# Altium project PCB_Project1.PrjPCB
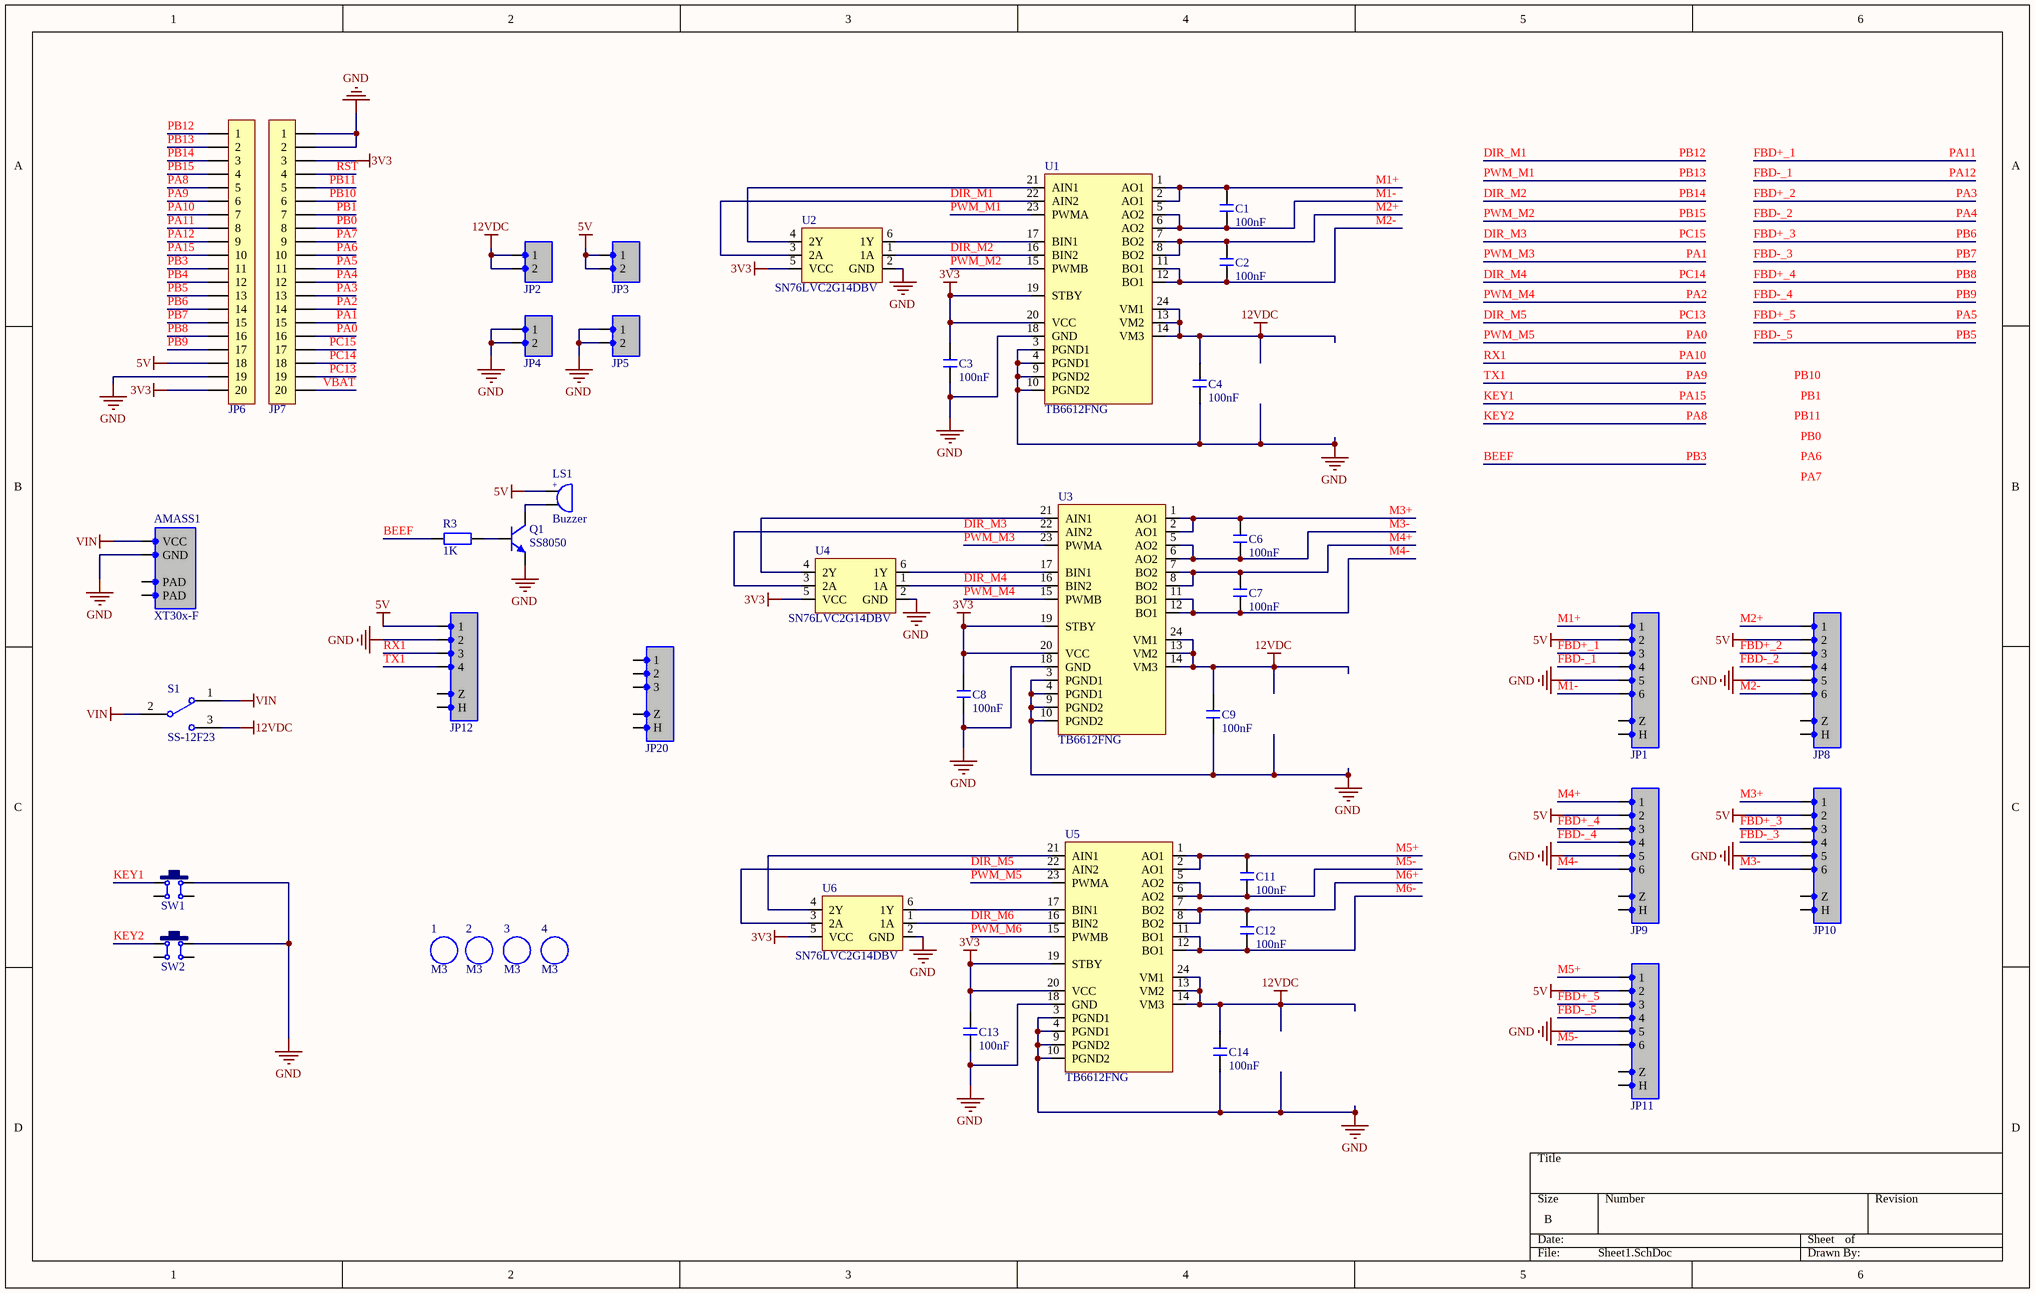
[diagram p0: Sheet1.SchDoc]
1 sheet, 42 parts. Net scope: global (net labels, ports and power ports of the same name join across sheets).
Board file: PCB1.PcbDoc

## Sheet Sheet1.SchDoc
size B

### Parts
1  M3  [M3 125X200]
2  M3  [M3 125X200]
3  M3  [M3 125X200]
4  M3  [M3 125X200]
AMASS1  XT30x-F  [XT30U-M]
C1  100nF  [C 0603_L]
C2  100nF  [C 0603_L]
C3  100nF  [C 0603_L]
C4  100nF  [C 1206_L]
C6  100nF  [C 0603_L]
C7  100nF  [C 0603_L]
C8  100nF  [C 0603_L]
C9  100nF  [C 1206_L]
C11  100nF  [C 0603_L]
C12  100nF  [C 0603_L]
C13  100nF  [C 0603_L]
C14  100nF  [C 1206_L]
JP1  HDR-1X6  [XH2.54-WI-6P]  (value not drawn)
JP2  HDR-1X2  [HDR2.54-LI-2P]  (value not drawn)
JP3  HDR-1X2  [HDR2.54-LI-2P]  (value not drawn)
JP4  HDR-1X2  [HDR2.54-LI-2P]  (value not drawn)
JP5  HDR-1X2  [HDR2.54-LI-2P]  (value not drawn)
JP6  HDR-1X20  [HDR2.54-LI-20P]  (value not drawn)
JP7  HDR-1X20  [HDR2.54-LI-20P]  (value not drawn)
JP8  HDR-1X6  [XH2.54-WI-6P]  (value not drawn)
JP9  HDR-1X6  [XH2.54-WI-6P]  (value not drawn)
JP10  HDR-1X6  [XH2.54-WI-6P]  (value not drawn)
JP11  HDR-1X6  [XH2.54-WI-6P]  (value not drawn)
JP12  HDR-1X4  [HDR2.54-LI-4P]  (value not drawn)
JP20  HDR-1X3  [HDR2.54-M-LI-3P]  (value not drawn)
LS1  Buzzer  [BUZZER_1260_I]
Q1  SS8050  [SOT23-3N]
R3  1K  [R 0603_L]
S1  SS-12F23  [SS-12D10]
SW1  6x6x5  [TSW SMD-6*6*4.3]  (value not drawn)
SW2  6x6x5  [TSW SMD-6*6*4.3]  (value not drawn)
U1  TB6612FNG  [SSOP24_N]
U2  SN76LVC2G14DBV  [SOT23-6N]
U3  TB6612FNG  [SSOP24_N]
U4  SN76LVC2G14DBV  [SOT23-6N]
U5  TB6612FNG  [SSOP24_N]
U6  SN76LVC2G14DBV  [SOT23-6N]

### Nets
3V3: C3.2 C8.2 C13.2 JP6.20 JP7.3 U1.19(STBY) U1.20(VCC) U2.5(VCC) U3.19(STBY) U3.20(VCC) U4.5(VCC) U5.19(STBY) U5.20(VCC) U6.5(VCC)
5V: JP1.2 JP3.1 JP3.2 JP6.18 JP8.2 JP9.2 JP10.2 JP11.2 JP12.1 LS1.1
12VDC: C4.2 C9.2 C14.2 JP2.1 JP2.2 S1.3 U1.13(VM2) U1.14(VM3) U1.24(VM1) U3.13(VM2) U3.14(VM3) U3.24(VM1) U5.13(VM2) U5.14(VM3) U5.24(VM1)
GND: AMASS1.2(GND) C3.1 C4.1 C8.1 C9.1 C13.1 C14.1 JP1.5 JP4.1 JP4.2 JP5.1 JP5.2 JP6.19 JP7.1 JP7.2 JP8.5 JP9.5 JP10.5 JP11.5 JP12.2 Q1.2(E) SW1.2 SW2.2 U1.3(PGND1) U1.4(PGND1) U1.9(PGND2) U1.10(PGND2) U1.18(GND) U2.2(GND) U3.3(PGND1) U3.4(PGND1) U3.9(PGND2) U3.10(PGND2) U3.18(GND) U4.2(GND) U5.3(PGND1) U5.4(PGND1) U5.9(PGND2) U5.10(PGND2) U5.18(GND) U6.2(GND)
VIN: AMASS1.1(VCC) S1.1 S1.2
BEEF: JP6.11 R3.2  [also labelled PB3]
DIR_M1: JP6.1 U1.22(AIN2) U2.3(2A)  [also labelled PB12]
DIR_M2: JP6.3 U1.16(BIN2) U2.1(1A)  [also labelled PB14]
DIR_M3: JP7.17 U3.22(AIN2) U4.3(2A)  [also labelled PC15]
DIR_M4: JP7.18 U3.16(BIN2) U4.1(1A)  [also labelled PC14]
DIR_M5: JP7.19 U5.22(AIN2) U6.3(2A)  [also labelled PC13]
DIR_M6: U5.16(BIN2) U6.1(1A)
FBD+_1: JP1.3 JP6.8  [also labelled PA11]
FBD+_2: JP7.13 JP8.3  [also labelled PA3]
FBD+_3: JP6.14 JP10.3  [also labelled PB6]
FBD+_4: JP6.16 JP9.3  [also labelled PB8]
FBD+_5: JP7.11 JP11.3  [also labelled PA5]
FBD-_1: JP1.4 JP6.9  [also labelled PA12]
FBD-_2: JP7.12 JP8.4  [also labelled PA4]
FBD-_3: JP6.15 JP10.4  [also labelled PB7]
FBD-_4: JP6.17 JP9.4  [also labelled PB9]
FBD-_5: JP6.13 JP11.4  [also labelled PB5]
KEY1: JP6.10 SW1.1  [also labelled PA15]
KEY2: JP6.5 SW2.1  [also labelled PA8]
M1+: C1.2 JP1.1 U1.1(AO1) U1.2(AO1)
M1-: C1.1 JP1.6 U1.5(AO2) U1.6(AO2)
M2+: C2.2 JP8.1 U1.7(BO2) U1.8(BO2)
M2-: C2.1 JP8.6 U1.11(BO1) U1.12(BO1)
M3+: C6.2 JP10.1 U3.1(AO1) U3.2(AO1)
M3-: C6.1 JP10.6 U3.5(AO2) U3.6(AO2)
M4+: C7.2 JP9.1 U3.7(BO2) U3.8(BO2)
M4-: C7.1 JP9.6 U3.11(BO1) U3.12(BO1)
M5+: C11.2 JP11.1 U5.1(AO1) U5.2(AO1)
M5-: C11.1 JP11.6 U5.5(AO2) U5.6(AO2)
M6+: C12.2 U5.7(BO2) U5.8(BO2)
M6-: C12.1 U5.11(BO1) U5.12(BO1)
PA0: JP7.16 U5.23(PWMA)  [also labelled PWM_M5]
PA1: JP7.15 U3.23(PWMA)  [also labelled PWM_M3]
PA2: JP7.14 U3.15(PWMB)  [also labelled PWM_M4]
PA6: JP7.10
PA7: JP7.9
PA9: JP6.6 JP12.4  [also labelled TX1]
PA10: JP6.7 JP12.3  [also labelled RX1]
PB0: JP7.8
PB1: JP7.7
PB4: JP6.12
PB10: JP7.6
PB11: JP7.5
PB13: JP6.2 U1.23(PWMA)  [also labelled PWM_M1]
PB15: JP6.4 U1.15(PWMB)  [also labelled PWM_M2]
PWM_M6: U5.15(PWMB)
RST: JP7.4
VBAT: JP7.20
NetLS1_2: LS1.2 Q1.3(C)
NetQ1_1: Q1.1(B) R3.1
NetU1_17: U1.17(BIN1) U2.6(1Y)
NetU1_21: U1.21(AIN1) U2.4(2Y)
NetU3_17: U3.17(BIN1) U4.6(1Y)
NetU3_21: U3.21(AIN1) U4.4(2Y)
NetU5_17: U5.17(BIN1) U6.6(1Y)
NetU5_21: U5.21(AIN1) U6.4(2Y)

Not connected (* = marked no-connect by the designer): AMASS1 0(PAD) 100(PAD); JP1 0(Z) 100(H); JP8 0(Z) 100(H); JP9 0(Z) 100(H); JP10 0(Z) 100(H); JP11 0(Z) 100(H); JP12 0(Z) 100(H); JP20 0(Z) 1 2 3 100(H); SW1 3 4; SW2 3 4

### Notes on the sheet
- Labels drawn without touching a wire or pin: PA6, PA7, PB0, PB1, PB10, PB11
- (in symbol Buzzer) +

### Library data of the parts
1-4 = M3: 铜柱孔; 版权归属: 源创客; BOM名称: 铜柱孔; 学习资源: www.ooocke.com
AMASS1 = XT30: Amass防打火电源接口，XT30系列
C1-C4 C6-C9 C11-C14 = C: 无极性贴片电容; 版权归属: 源创客; BOM名称: 无极性贴片电容; 学习资源: www.ooocke.com
JP1 JP8-JP11 = Header 6: 6P接插件; 版权归属: 源创客; BOM名称: 6P接插件; 学习资源: www.ooocke.com
JP2-JP5 = Header 2: 2P接插件; 版权归属: 源创客; BOM名称: 2P接插件; 学习资源: www.ooocke.com
JP6 JP7 = Header 20: 20P接插件; 版权归属: 源创客; BOM名称: 20P接插件; 学习资源: www.ooocke.com
JP12 = Header 4: 4P接插件; 版权归属: 源创客; BOM名称: 4P接插件; 学习资源: www.ooocke.com
JP20 = Header 3: 3P接插件; 版权归属: 源创客; BOM名称: 3P接插件; 学习资源: www.ooocke.com
LS1 = Buzzer: 蜂鸣器; 版权归属: 源创客; BOM名称: 蜂鸣器; 学习资源: www.ooocke.com
Q1 = 8050-SMD: 高频放大-NPN型; 版权归属: 源创客; 属性: 40V 1.5A 1W 100MHZ; BOM名称: 高频放大-NPN型; 学习资源: www.ooocke.com
R3 = R: 贴片电阻; 版权归属: 源创客; BOM名称: 贴片电阻; 学习资源: www.ooocke.com
S1 = SSW-1P: 1路拨动开关; BOM名称: 波动开关; 版权归属: 源创客; 学习资源: www.ooocke.com
SW1 SW2 = TSW SMD-6x6: 贴片6x6轻触开关; 版权归属: 源创客; BOM名称: 贴片6x6轻触开关; 学习资源: www.ooocke.com
U1 U3 U5 = Component_1